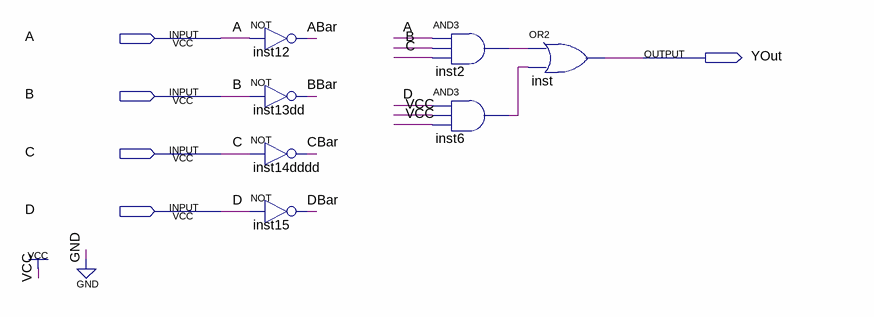
[diagram p0: schematic sheet]
// Quartus schematic YOut.bdf as structural Verilog: 7 symbols, 5 pins
module YOut (
  input  A,
  input  B,
  input  C,
  input  D,
  output YOut
);

  wire ABar, BBar, CBar, DBar, inst2_out, inst6_out;

  not inst12 (ABar, A);
  not inst13dd (BBar, B);
  not inst14dddd (CBar, C);
  not inst15 (DBar, D);
  and inst2 (inst2_out, A, B, C);
  and inst6 (inst6_out, D, 1'b1, 1'b1);
  or inst (YOut, inst2_out, inst6_out);
endmodule
